# Altium schematic sheet 05.SSRs.SchDoc
size A4; SPICEModelCache: <root> / <DocumentId>WVACCUDR</DocumentId> / <CacheFrame Number="0"> / <Model Name="cap" Kind="MDL"> / <Text>*Default semiconductor capacitor / .MODEL CAP C()</Text> / </Model> / </CacheFrame> / </root>; DocumentNumber: 06; SheetNumber: 6; SheetTotal: 8; Page: SSR Channels
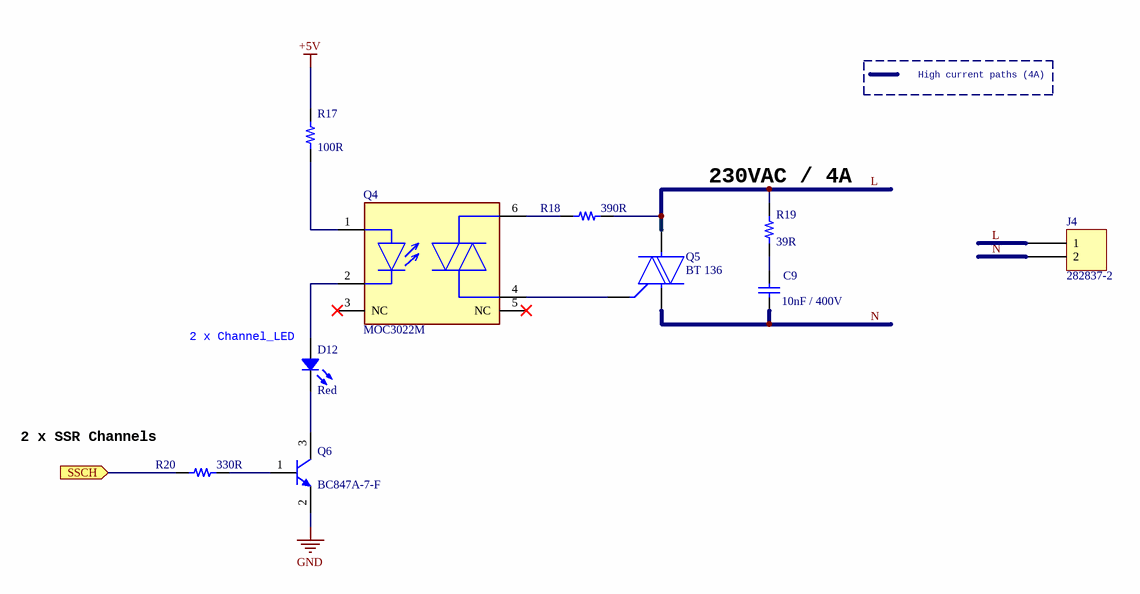
[diagram p0: 05.SSRs.SchDoc]

## Parts
C9  10nF / 400V  [CAPRR1000W60L1200T500H830]
D12  Red  [LED 0603_1608 RED]
J4  282837-2  [TE 282837-2]
Q4  MOC3022M  [FP-646BY-MFG]
Q5  BT 136  [FP-TO-220AB_Ins-MFG]
Q6  BC847A-7-F  [DIODES SOT-23-3]
R17  100R  [RES 0603_1608]
R18  390R  [RES 1206_3216]
R19  39R  [RES 1210_3225]
R20  330R  [RES 0603_1608]

## Ports
SSCH (in)

## Nets
+5V: R17.2
GND: Q6.2(E)
L: J4.1 Q5.2(A2) R18.2 R19.2
N: C9.2 J4.2 Q5.1(A1)
SSCH: R20.1 ; port SSCH
NetC9_1: C9.1 R19.1
NetD12_1: D12.1 Q4.2(C)
NetD12_2: D12.2 Q6.3(C)
NetQ4_1: Q4.1(A) R17.1
NetQ4_4: Q4.4(1_MAIN_TERM.) Q5.3(G)
NetQ4_6: Q4.6(2_MAIN_TERM.) R18.1
NetQ6_1: Q6.1(B) R20.2

Not connected (* = marked no-connect by the designer): Q4 3(NC)* 5(NC)*

## Notes on the sheet
- High current paths (4A)
- (near R19) 230VAC / 4A
- (near D12) 2 x Channel_LED
- 2 x SSR Channels
- Title :
- Size:
- Date:
- Page :
- A4
- Number:
- Time:
- Revision:
- Sheet
- of
- Sheet Name :
- Drawn By :

## Library data of the parts
C9 = Cap: 10nF ±5% 400V Plugin,P=10mm Polypropylene Film Capacitors (CBB) ROHS; Manufacturer Part Number: CFC2G103JE1J12075100; Manufacturer: Dersonic; JLC Part Number: C2681665; Value: 10nF / 400V
D12 = 5973005507F: -40℃~+85℃ Red 0603 Light Emitting Diodes (LED) ROHS; Manufacturer Part Number: KT-0603R; Manufacturer: Hubei KENTO Elec; JLC Part Number: C2286
J4 = 282837-2: TERM BLK 2P SIDE ENT 5.08MM PCB; Manufacturer: TE Connectivity AMP Connectors; Manufacturer Part Number: 282837-2; JLC Part Number: C592976
Q4 = CMP-00278-84330365-1: 60mA 400V 1.15V Two-way thyristor DIP-6 Optocouplers - Thyristor Signal Output ROHS; Manufacturer: UMW(Youtai Semiconductor Co., Ltd.); Part Number: MOC3022M; JLC Part Number: C2842958
Q5 = CMP-12193-000006-1: 1W 4A 27A 1个双向可控硅 TO-220 TRIACs ROHS; Manufacturer: KY; Manufacturer Part Number: BT136-800E; JLC Part Number: C2831690
Q6 = BC847A-7-F: 65V 310mW 180@2mA,5V 100mA NPN SOT-23 Bipolar Transistors - BJT ROHS; Manufacturer: Diodes Incorporated; Manufacturer Part Number: BC847A-7-F; JLC Part Number: C2760576
R17 = CRCW0603100RJNEAIF: 100mW Thick Film Resistors ±5% ±200ppm/℃ 100Ω 0603 Chip Resistor - Surface Mount ROHS; Manufacturer Part Number: TR0603D100RP0550Z; Manufacturer: Ever Ohms Tech; Value: 100R; JLC Part Number: C5250752
R18 = RT1206BRD07150RL: 250mW Thick Film Resistors ±100ppm/℃ ±5% 390Ω 1206 Chip Resistor - Surface Mount ROHS; Manufacturer Part Number: 1206W4J0391T5E; Manufacturer: UNI-ROYAL(Uniroyal Elec); Value: 390R; JLC Part Number: C25378
R19 = RK73B2ETTD471J: 750mW Thick Film Resistors ±5% ±200ppm/℃ 39Ω 1210 Chip Resistor - Surface Mount ROHS; Manufacturer Part Number: CR1210J30390G; Manufacturer: LIZ Elec; Value: 39R; JLC Part Number: C102462
R20 = CRGP0603F560R: 100mW Thick Film Resistors ±100ppm/℃ ±1% 330Ω 0603 Chip Resistor - Surface Mount ROHS; Manufacturer Part Number: 0603WAF3300T5E; Manufacturer: UNI-ROYAL(Uniroyal Elec); Value: 330R; JLC Part Number: C23138